# Altium schematic sheet Motor.SchDoc
size A; SheetNumber: 3; SheetTotal: 7
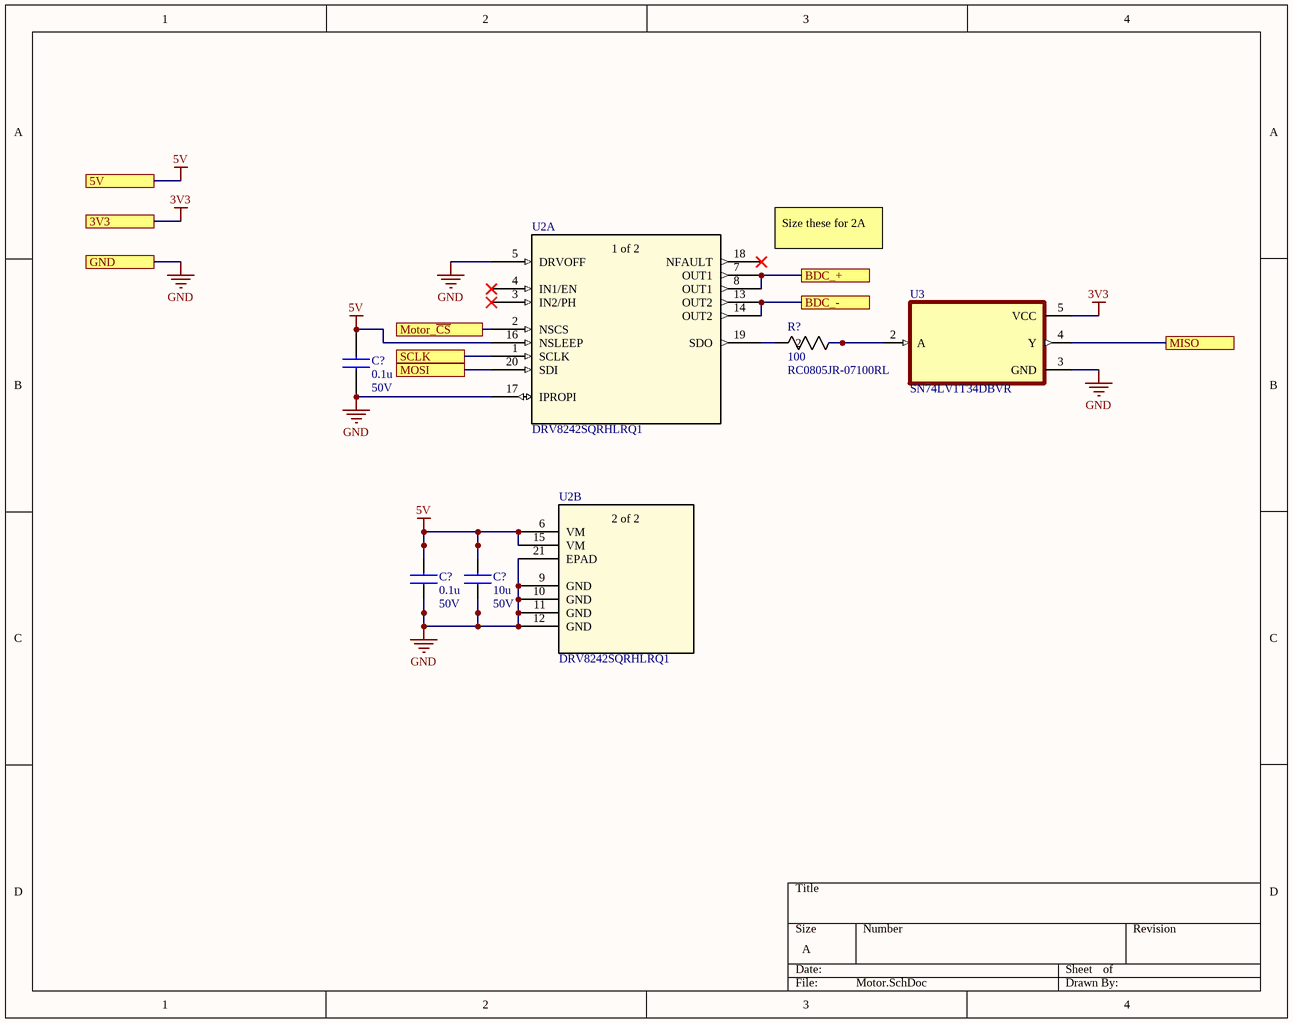
[diagram p0: Motor.SchDoc]

## Parts
(Parts that share a designator on the sheet are numbered #1, #2 ... from top to bottom, then left to right.)
C?#1  value 0.1u  Rated Voltage: 50V  [CAPC2012X145N]  (hidden comment: KAM21BR71H104JM)
C?#2  value 0.1u  Rated Voltage: 50V  [CAPC2012X145N]  (hidden comment: KAM21BR71H104JM)
C?#3  value 10u  Rated Voltage: 50V  [CAPC2012X145N]  (hidden comment: C2012X5R1H106K125AC)
R?  RC0805JR-07100RL  value 100  [RC0805N_YAG]
U2  DRV8242SQRHLRQ1  [VQFN20_RHL_TEX]  (parts A,B of 2)
U3  SN74LV1T34DBVR  [SOT95P280X145-5N]

## Ports
3V3, 5V, BDC_+, BDC_-, GND, MISO, MOSI, Motor_~{CS}, SCLK

## Nets
3V3: U3.5(VCC) ; port 3V3
5V: C?#1.2 C?#2.2 C?#3.2 U2.6(VM) U2.15(VM) U2.16(NSLEEP) ; port 5V
GND: C?#1.1 C?#2.1 C?#3.1 U2.5(DRVOFF) U2.9(GND) U2.10(GND) U2.11(GND) U2.12(GND) U2.17(IPROPI) U2.21(EPAD) U3.3(GND) ; port GND
BDC_+: U2.7(OUT1) U2.8(OUT1) ; port BDC_+
BDC_-: U2.13(OUT2) U2.14(OUT2) ; port BDC_-
MISO: U3.4(Y) ; port MISO
MOSI: U2.20(SDI) ; port MOSI
Motor_~{CS}: U2.2(NSCS) ; port Motor_~{CS}
SCLK: U2.1(SCLK) ; port SCLK
NetR?_1: R?.1 U3.2(A)
NetR?_2: R?.2 U2.19(SDO)

Not connected (* = marked no-connect by the designer): U2 3(IN2/PH)* 4(IN1/EN)* 18(NFAULT)*

## Notes on the sheet
- Size these for 2A
- (in symbol DRV8242SQRHLRQ1, part A) 1 of 2
- (in symbol DRV8242SQRHLRQ1, part B) 2 of 2

## Library data of the parts
C?#1 C?#2 = KAM21BR71H104JM: Multilayer Ceramic Chip Capacitors, Capacitance=0.1u; Manufacturer_Part_Number: KAM21BR71H104JM
C?#3 = C2012X5R1H106K125AC: Multilayer Ceramic Chip Capacitors, Capacitance=10?F, LxWxT:2x1.25x1.25mm; Manufacturer_Name: TDK; Geometry.Height: 1.45mm; Mouser Part Number: 810-C2012X5R1H106K12; Mouser Price/Stock: https://www.mouser.co.uk/ProductDetail/TDK/C2012X5R1H106K125AC?qs=rSMjJ%252B1ewcQGpfDVduhUmg%3D%3D; Manufacturer_Part_Number: C2012X5R1H106K125AC; Datasheet Link: https://product.tdk.com/info/en/catalog/datasheets/mlcc_commercial_midvoltage_en.pdf
R? = RC0805JR-07100RL: RES 0805 100 5% 1/8W; Manufacturer_Name: Yageo; Manufacturer_Part_Number: RC0805JR-07100RL; Tolerance: 5%
U2 = DRV8242SQRHLRQ1: Automotive, 40-V 6-A H-bridge driver with integrated current sensing and feedback 20-VQFN -40 to 125; Manufacturer_Name: Texas Instruments; Type: Power Management; Copyright: Copyright (C) 2025 Ultra Librarian. All rights reserved.; Manufacturer_Part_Number: DRV8242SQRHLRQ1; Datasheet: https://www.ti.com/lit/gpn/drv8242-q1; RefDes: RefDes
U3 = SN74LV1T34DBVR: Single Power Supply BUFFER Logic Level Shifter (no enable); MF: Texas Instruments; SnapEDA_Link: https://www.snapeda.com/parts/SN74LV1T34DBVR/Texas+Instruments/view-part/?ref=snap; Package: SOT-23-5 Texas Instruments; Value: *; MP: SN74LV1T34DBVR; Check_prices: https://www.snapeda.com/parts/SN74LV1T34DBVR/Texas+Instruments/view-part/?ref=eda